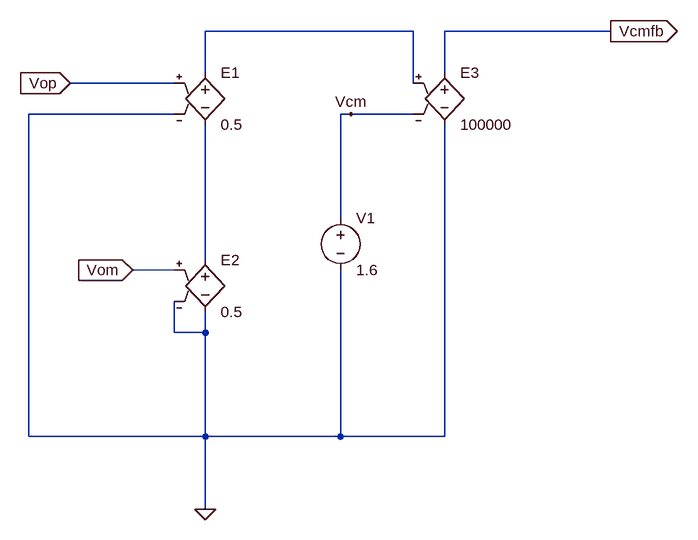
[diagram p0: schematic cmfb.asc]
cmfb.asc, the LTspice schematic file:
Version 4
SHEET 1 948 836
WIRE 512 80 192 80
WIRE 816 80 560 80
WIRE 192 144 192 80
WIRE 560 144 560 80
WIRE 144 160 -16 160
WIRE 512 160 512 80
WIRE 144 208 -80 208
WIRE 416 208 400 208
WIRE 512 208 416 208
WIRE 400 368 400 208
WIRE 192 432 192 224
WIRE 144 448 80 448
WIRE 144 544 144 496
WIRE 192 544 192 512
WIRE 192 544 144 544
WIRE -80 704 -80 208
WIRE 192 704 192 544
WIRE 192 704 -80 704
WIRE 400 704 400 448
WIRE 400 704 192 704
WIRE 560 704 560 224
WIRE 560 704 400 704
WIRE 192 816 192 704
FLAG 192 816 0
FLAG 416 208 Vcm
FLAG -16 160 Vop
IOPIN -16 160 In
FLAG 80 448 Vom
IOPIN 80 448 In
FLAG 816 80 Vcmfb
IOPIN 816 80 Out
SYMBOL e 192 128 R0
SYMATTR InstName E1
SYMATTR Value 0.5
SYMBOL e 192 416 R0
SYMATTR InstName E2
SYMATTR Value 0.5
SYMBOL e 560 128 R0
SYMATTR InstName E3
SYMATTR Value 100000
SYMBOL voltage 400 352 R0
WINDOW 123 0 0 Left 0
WINDOW 39 0 0 Left 0
SYMATTR InstName V1
SYMATTR Value 1.6

The netlist it stands for:
* cmfb.asc
E1 N001 N002 Vop 0 0.5
E2 N002 0 Vom 0 0.5
E3 Vcmfb 0 N001 Vcm 100000
V1 Vcm 0 1.6
.backanno
.end